# Altium project DM2080.PrjPcb (part 1 of 6)
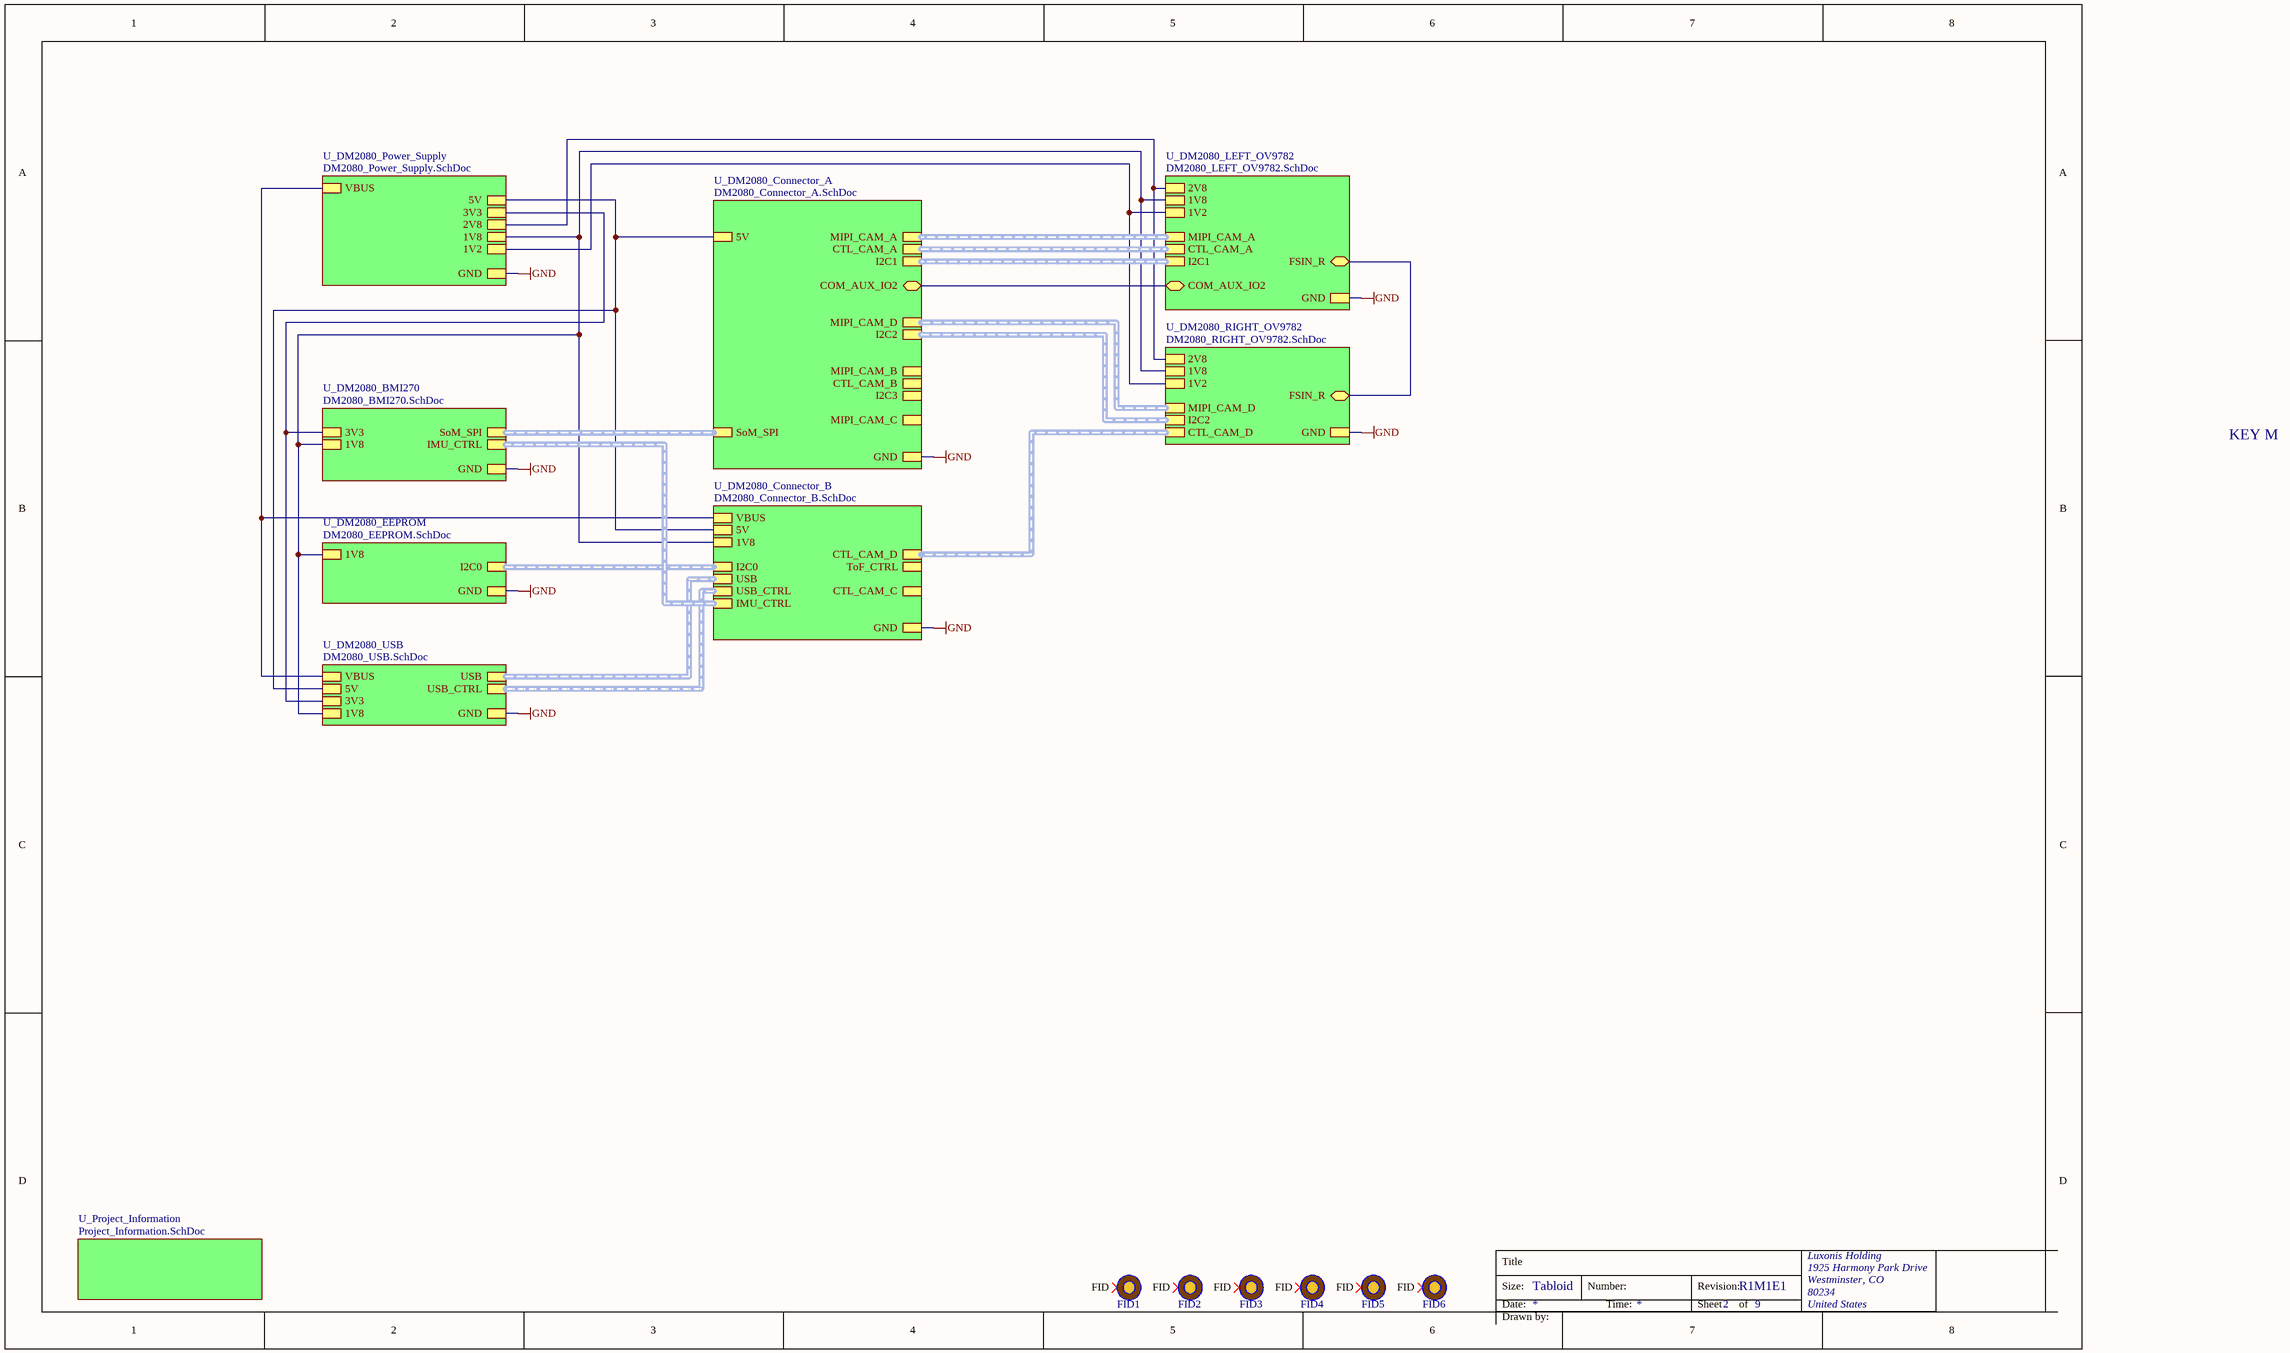
[diagram p0: TopLevel.SchDoc]
document_number: D0001093; drawn_by: David Malovrh; project_title: DM2080; revision: R1M1E1; variant: =Variant
10 sheets, 159 parts. Net scope: strictly hierarchical (ports join the sheet entries above them; power ports are local).
Board file: DM2080.PcbDoc
Sheets:
  TopLevel.SchDoc
    U_DM2080_BMI270 = DM2080_BMI270.SchDoc
    U_DM2080_Connector_A = DM2080_Connector_A.SchDoc
    U_DM2080_Connector_B = DM2080_Connector_B.SchDoc
    U_DM2080_LEFT_OV9782 = DM2080_LEFT_OV9782.SchDoc
    U_DM2080_Power_Supply = DM2080_Power_Supply.SchDoc
    U_DM2080_RIGHT_OV9782 = DM2080_RIGHT_OV9782.SchDoc
    U_DM2080_USB = DM2080_USB.SchDoc
    U_Project_Information = Project_Information.SchDoc
    U_DM2080_EEPROM = DM2080_EEPROM.SchDoc

## Sheet TopLevel.SchDoc: =project_title
size Tabloid; PageSetup: Record=PageOptions|CenterHorizontal=True|CenterVertical=True|PrintScale=0.73|XCorrection=1.00|YCorrection=1.00|PrintKind=0|BorderSize=5000000|LeftOffset=0|BottomOffset=0|Orientation=2|PaperLength=1000|PaperWidth=1000|Scale=100|PaperSource=7|PrintQuality=-4|MediaType=1|DitherType=10|PaperKind=A4|PrintScaleMode=1; CompanyName: Luxonis Holding; DrawnBy: David Malovrh; Organization: Luxonis Holding; Address1: 1925 Harmony Park Drive; Address2: Westminster, CO; Address3: 80234; Address4: United States; DocumentNumber: D0001093; Revision: R1M1E1; SheetNumber: 2; SheetTotal: 9

### Parts
FID1  FIDUCIAL_ROUND_1MM  [FIDUCIAL_ROUND_1MM]  (value not drawn)  (no BOM)
FID2  FIDUCIAL_ROUND_1MM  [FIDUCIAL_ROUND_1MM]  (value not drawn)  (no BOM)
FID3  FIDUCIAL_ROUND_1MM  [FIDUCIAL_ROUND_1MM]  (value not drawn)  (no BOM)
FID4  FIDUCIAL_ROUND_1MM  [FIDUCIAL_ROUND_1MM]  (value not drawn)  (no BOM)
FID5  FIDUCIAL_ROUND_1MM  [FIDUCIAL_ROUND_1MM]  (value not drawn)  (no BOM)
FID6  FIDUCIAL_ROUND_1MM  [FIDUCIAL_ROUND_1MM]  (value not drawn)  (no BOM)

### Sub-sheets
U_DM2080_BMI270 = DM2080_BMI270.SchDoc: GND, 3V3, 1V8, SoM_SPI (harness MX_SPI0), IMU_CTRL (harness IMU_CTRL)
U_DM2080_Connector_A = DM2080_Connector_A.SchDoc: MIPI_CAM_B (harness MIPI_CAM_B), I2C1 (harness I2C1), CTL_CAM_B (harness CTL_CAM_B), I2C2 (harness I2C2), MIPI_CAM_A (harness MIPI_CAM_A), CTL_CAM_A (harness CTL_CAM_A), MIPI_CAM_D (harness MIPI_CAM_D), COM_AUX_IO2 (bidir), I2C3 (harness I2C3), SoM_SPI (harness SoM_SPI), GND, MIPI_CAM_C (harness MIPI_CAM_C), 5V
U_DM2080_Connector_B = DM2080_Connector_B.SchDoc: 5V, GND, USB (harness USB_KB), 1V8, I2C0 (harness I2C0), IMU_CTRL (harness IMU_CTRL), ToF_CTRL (harness ToF_CTRL), USB_CTRL (harness USB_CTRL), CTL_CAM_D (harness CTL_CAM_D), VBUS, CTL_CAM_C (harness CTL_CAM_C)
U_DM2080_EEPROM = DM2080_EEPROM.SchDoc: 1V8, GND, I2C0 (harness I2C0)
U_DM2080_LEFT_OV9782 = DM2080_LEFT_OV9782.SchDoc: 1V2, 2V8, GND, 1V8, MIPI_CAM_A (harness MIPI_CAM_A), I2C1 (harness I2C1), CTL_CAM_A (harness CTL_CAM_A), COM_AUX_IO2 (bidir), FSIN_R (bidir)
U_DM2080_Power_Supply = DM2080_Power_Supply.SchDoc: 1V2, 2V8, GND, 3V3, 5V, VBUS, 1V8
U_DM2080_RIGHT_OV9782 = DM2080_RIGHT_OV9782.SchDoc: 1V2, 2V8, GND, 1V8, MIPI_CAM_D (harness MIPI_CAM_D), I2C2 (harness I2C2), CTL_CAM_D (harness CTL_CAM_A), FSIN_R (bidir)
U_DM2080_USB = DM2080_USB.SchDoc: USB (harness USB), VBUS, GND, 3V3, 5V, USB_CTRL (harness USB_CTRL), 1V8
U_Project_Information = Project_Information.SchDoc: no entries

### Nets
1V2: sheet U_DM2080_LEFT_OV9782/1V2, sheet U_DM2080_Power_Supply/1V2, sheet U_DM2080_RIGHT_OV9782/1V2
1V8: sheet U_DM2080_BMI270/1V8, sheet U_DM2080_Connector_B/1V8, sheet U_DM2080_LEFT_OV9782/1V8, sheet U_DM2080_Power_Supply/1V8, sheet U_DM2080_RIGHT_OV9782/1V8, sheet U_DM2080_USB/1V8, sheet U_DM2080_EEPROM/1V8
2V8: sheet U_DM2080_LEFT_OV9782/2V8, sheet U_DM2080_Power_Supply/2V8, sheet U_DM2080_RIGHT_OV9782/2V8
3V3: sheet U_DM2080_BMI270/3V3, sheet U_DM2080_Power_Supply/3V3, sheet U_DM2080_USB/3V3
5V: sheet U_DM2080_Connector_A/5V, sheet U_DM2080_Connector_B/5V, sheet U_DM2080_Power_Supply/5V, sheet U_DM2080_USB/5V
GND: sheet U_DM2080_BMI270/GND, sheet U_DM2080_Connector_A/GND, sheet U_DM2080_Connector_B/GND, sheet U_DM2080_LEFT_OV9782/GND, sheet U_DM2080_Power_Supply/GND, sheet U_DM2080_RIGHT_OV9782/GND, sheet U_DM2080_USB/GND, sheet U_DM2080_EEPROM/GND
VBUS: sheet U_DM2080_Connector_B/VBUS, sheet U_DM2080_Power_Supply/VBUS, sheet U_DM2080_USB/VBUS
COM_AUX_IO2: sheet U_DM2080_Connector_A/COM_AUX_IO2, sheet U_DM2080_LEFT_OV9782/COM_AUX_IO2
FSIN_R: sheet U_DM2080_LEFT_OV9782/FSIN_R, sheet U_DM2080_RIGHT_OV9782/FSIN_R

Not connected (* = marked no-connect by the designer): FID1 FID*; FID2 FID*; FID3 FID*; FID4 FID*; FID5 FID*; FID6 FID*

### Buses and harness runs
harness sheet U_DM2080_BMI270/IMU_CTRL = sheet U_DM2080_Connector_B/IMU_CTRL
harness sheet U_DM2080_BMI270/SoM_SPI = sheet U_DM2080_Connector_A/SoM_SPI
harness sheet U_DM2080_Connector_A/CTL_CAM_A = sheet U_DM2080_LEFT_OV9782/CTL_CAM_A
harness sheet U_DM2080_Connector_A/I2C1 = sheet U_DM2080_LEFT_OV9782/I2C1
harness sheet U_DM2080_Connector_A/I2C2 = sheet U_DM2080_RIGHT_OV9782/I2C2
harness sheet U_DM2080_Connector_A/MIPI_CAM_A = sheet U_DM2080_LEFT_OV9782/MIPI_CAM_A
harness sheet U_DM2080_Connector_A/MIPI_CAM_D = sheet U_DM2080_RIGHT_OV9782/MIPI_CAM_D
harness sheet U_DM2080_Connector_B/CTL_CAM_D = sheet U_DM2080_RIGHT_OV9782/CTL_CAM_D
harness sheet U_DM2080_Connector_B/I2C0 = sheet U_DM2080_EEPROM/I2C0
harness sheet U_DM2080_Connector_B/USB = sheet U_DM2080_USB/USB
harness sheet U_DM2080_Connector_B/USB_CTRL = sheet U_DM2080_USB/USB_CTRL

### Notes on the sheet
- KEY M
- Title
- Size:
- Date:
- Tabloid
- Number:
- Time:
- Revision:
- Sheet
- of
- Drawn by:

### Library data of the parts
FID1-FID6 = FIDUCIAL: Fiducial with various available footprints

## Sheet DM2080_BMI270.SchDoc: =project_title
size Tabloid; CompanyName: Luxonis Holding; DrawnBy: David Malovrh; Organization: Luxonis Holding; Address1: 1925 Harmony Park Drive; Address2: Westminster, CO; Address3: 80234; Address4: United States; DocumentNumber: D0001093; SheetNumber: 9; SheetTotal: 9
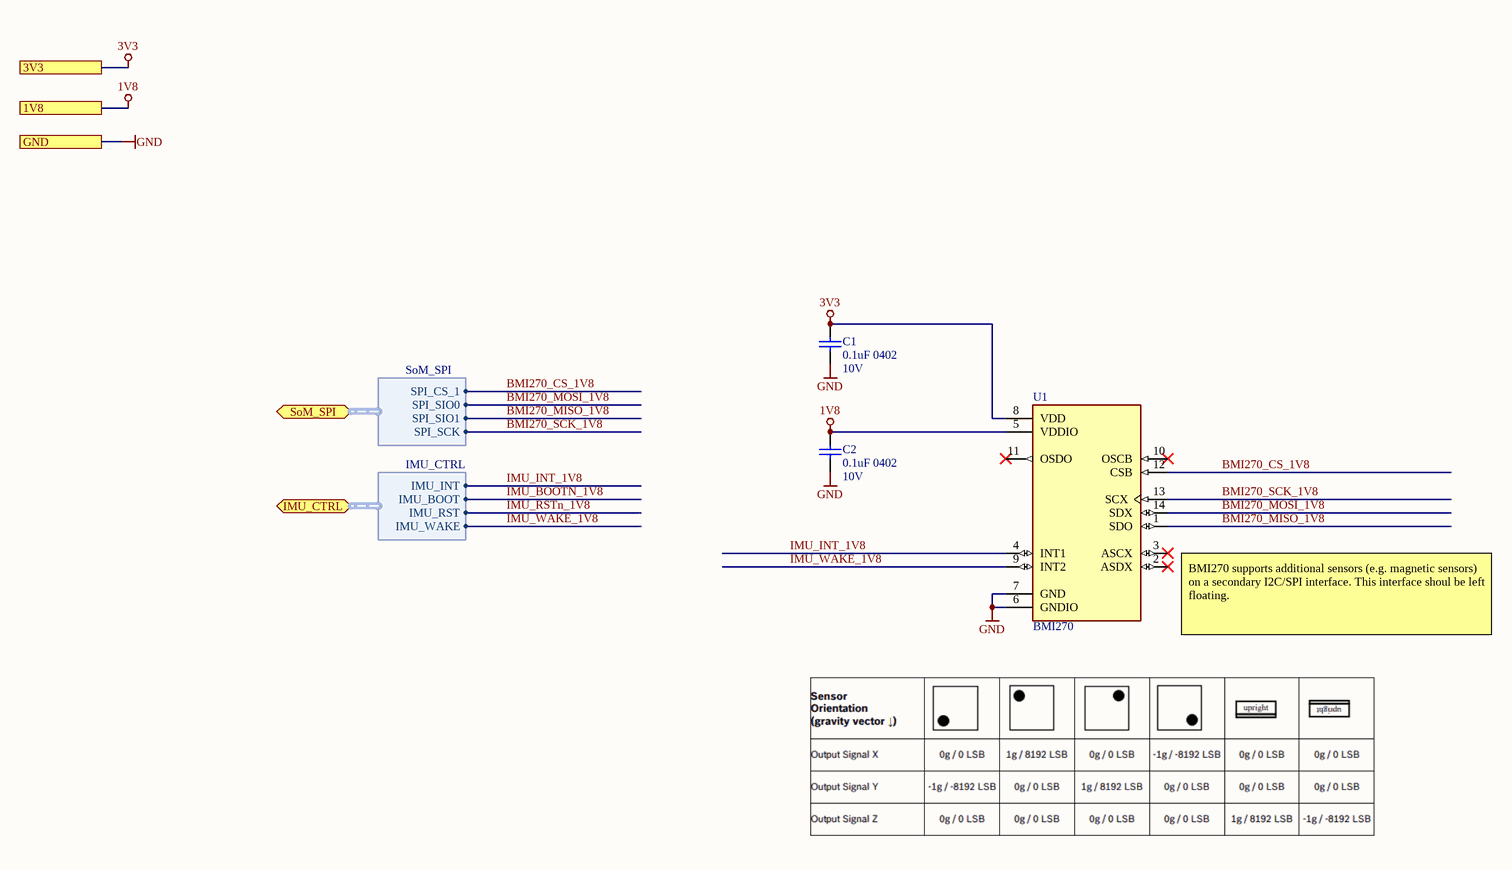
[diagram p1: DM2080_BMI270.SchDoc]

### Parts
C1  0.1uF 0402  Voltage Rating: 10V  [CAPC0402(1005)70_L]
C2  0.1uF 0402  Voltage Rating: 10V  [CAPC0402(1005)70_L]
U1  BMI270  [XDCR_BMI270]

### Ports
1V8, 3V3, GND, IMU_CTRL (bidir, harness IMU_CTRL), SoM_SPI (bidir, harness SoM_SPI)

### Harnesses
SoM_SPI: SPI_SIO0, SPI_SIO1, SPI_CS_1, SPI_SCK
IMU_CTRL: IMU_BOOT, IMU_RST, IMU_INT, IMU_WAKE

### Nets
1V8: C2.2 U1.5(VDDIO) ; port 1V8
3V3: C1.2 U1.8(VDD) ; port 3V3
GND: C1.1 C2.1 U1.6(GNDIO) U1.7(GND) ; port GND
BMI270_CS_1V8: U1.12(CSB) ; port SoM_SPI.SPI_CS_1
BMI270_MISO_1V8: U1.1(SDO) ; port SoM_SPI.SPI_SIO1
BMI270_MOSI_1V8: U1.14(SDX) ; port SoM_SPI.SPI_SIO0
BMI270_SCK_1V8: U1.13(SCX) ; port SoM_SPI.SPI_SCK
IMU_INT_1V8: U1.4(INT1) ; port IMU_CTRL.IMU_INT
IMU_WAKE_1V8: U1.9(INT2) ; port IMU_CTRL.IMU_WAKE

Not connected (* = marked no-connect by the designer): U1 2(ASDX)* 3(ASCX)* 10(OSCB)* 11(OSDO)*

### Notes on the sheet
- (near U1) BMI270 supports additional sensors (e.g. magnetic sensors) on a secondary I2C/SPI interface. This interface shoul be left floating.
- Title
- Size:
- Date:
- Tabloid
- Number:
- Time:
- Revision:
- Sheet
- of
- Drawn by:

### Library data of the parts
C1 C2 = GRM155R71A104JA01D: CAP CER 0.1UF 10V X7R 0402 5%; Manufacturer 1: Murata; Capacitance: 100nF; Supplier 1: Digi-Key; Manufacturer Part Number 1: GRM155R71A104JA01D; Stock 1: 1346709; Pricing 1: 1=0.10000, 10=0.02500, 100=0.01130, 500=0.00806, 1000=0.00633, 2500=0.00575, 5000=0.00529 (USD); RoHS: Yes; Mount: Surface Mount; Case/Package: 0402; Case Code (Imperial): 0402; Case Code (Metric): 1005; Min Operating Temperature: -55°C; Max Operating Temperature: 125°C; Tolerance: 5%; Packaging: Tape and Reel; Voltage Rating (DC): 10V; Dielectric: X7R; Package Quantity: 10000; Termination: SMD/SMT; Length: 1mm; Height: 0.5mm; Width: 0.02inch; Thickness: 0.022inch; Depth: 0.5mm; Radiation Hardening: No; Lead Free: Lead Free; ComponentLink1URL: https://datasheet.ciiva.com/5411/product-5411135.pdf?src-supplier=Mouser; ComponentLink1Description: https://datasheet.ciiva.com/5411/product-5411135.pdf?src-supplier=Mouser; ComponentLink2URL: https://datasheet.ciiva.com/11618/c02e-11618821.pdf?src-supplier=Avnet; ComponentLink2Description: https://datasheet.ciiva.com/11618/c02e-11618821.pdf?src-supplier=Avnet; Supplier Part Number 1: 490-10777-1-ND
U1 = BMI270: Accelerometer, Gyroscope, 6 Axis Sensor IÂ²C, SPI Output; Manufacturer 1: Bosch Sensortec; Price: None; SnapEDA_Link: https://www.snapeda.com/parts/BMI270/Bosch%20Sensortec/view-part/3595167/?ref=snap; Manufacturer Part Number 1: BMI270; Availability: Unavailable; Value: *; Package: LGA-14 Bosch Sensortec

## Sheet DM2080_Connector_A.SchDoc: =project_title
size Tabloid; CompanyName: Luxonis Holding; DrawnBy: David Malovrh; Organization: Luxonis Holding; Address1: 1925 Harmony Park Drive; Address2: Westminster, CO; Address3: 80234; Address4: United States; DocumentNumber: D0001093; Revision: R1M1E1; SheetNumber: 3; SheetTotal: 12
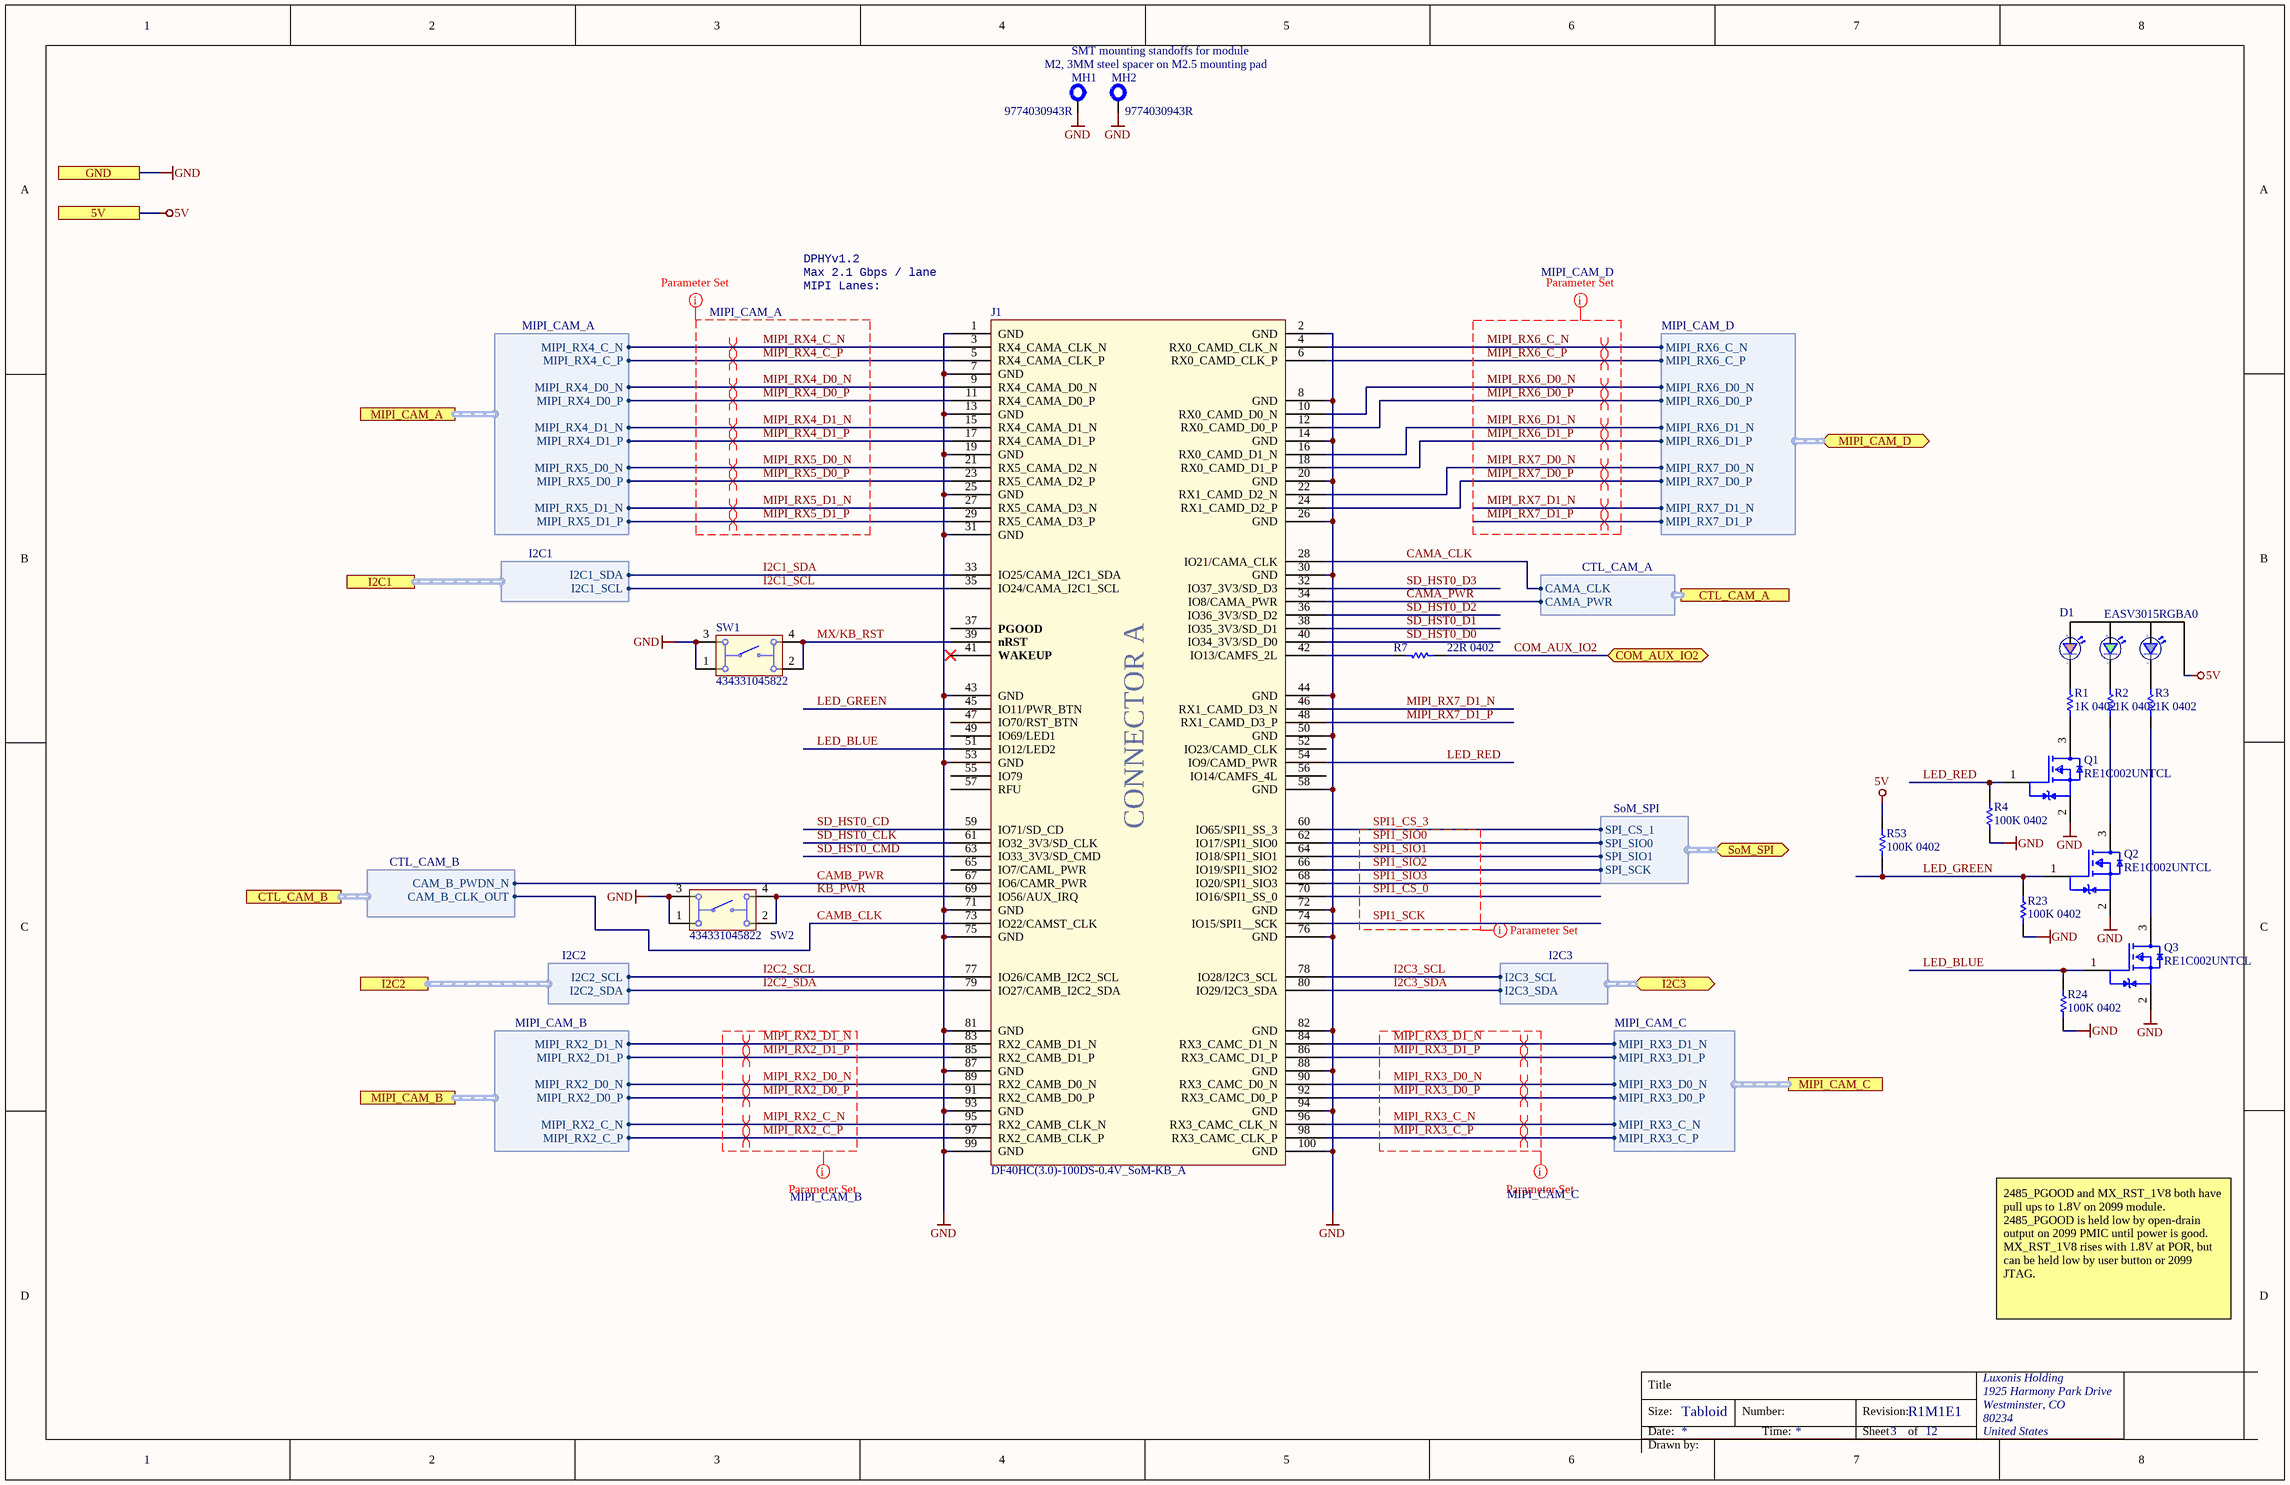
[diagram p2: DM2080_Connector_A.SchDoc]

### Parts
D1  EASV3015RGBA0  [EASV3015RGBA0]
J1  DF40HC(3.0)-100DS-0.4V_SoM-KB_A  [CON_A_SoM-Pro-KB_DF40HC-3.0-100DS-0.4V_minpad]
MH1  9774030943R  [9774030943R]
MH2  9774030943R  [9774030943R]
Q1  RE1C002UNTCL  [RE1C002UNTCL]
Q2  RE1C002UNTCL  [RE1C002UNTCL]
Q3  RE1C002UNTCL  [RE1C002UNTCL]
R1  1K 0402  [RESC0402(1005)_L]
R2  1K 0402  [RESC0402(1005)_L]
R3  1K 0402  [RESC0402(1005)_L]
R4  100K 0402  [RESC0402(1005)_L]
R7  22R 0402  [RESC0402(1005)_L]
R23  100K 0402  [RESC0402(1005)_L]
R24  100K 0402  [RESC0402(1005)_L]
R53  100K 0402  [RESC0402(1005)_L]
SW1  434331045822  [434331045822]
SW2  434331045822  [434331045822]

### Ports
5V, COM_AUX_IO2 (bidir), CTL_CAM_A (harness CTL_CAM_A), CTL_CAM_B (harness CTL_CAM_B), GND, I2C1 (harness I2C1), I2C2 (harness I2C2), I2C3 (bidir, harness I2C3), MIPI_CAM_A (harness MIPI_CAM_A), MIPI_CAM_B (harness MIPI_CAM_B), MIPI_CAM_C (harness MIPI_CAM_C), MIPI_CAM_D (bidir, harness MIPI_CAM_D), SoM_SPI (bidir, harness SoM_SPI)

### Harnesses
MIPI_CAM_B: MIPI_RX2_C_P, MIPI_RX2_C_N, MIPI_RX2_D0_P, MIPI_RX2_D0_N, MIPI_RX2_D1_P, MIPI_RX2_D1_N
MIPI_CAM_C: MIPI_RX3_C_P, MIPI_RX3_C_N, MIPI_RX3_D0_P, MIPI_RX3_D0_N, MIPI_RX3_D1_P, MIPI_RX3_D1_N
I2C1: I2C1_SDA, I2C1_SCL
CTL_CAM_B: CAM_B_CLK_OUT, CAM_B_PWDN_N
I2C2: I2C2_SDA, I2C2_SCL
MIPI_CAM_A: MIPI_RX4_C_P, MIPI_RX4_C_N, MIPI_RX4_D0_P, MIPI_RX4_D0_N, MIPI_RX4_D1_P, MIPI_RX4_D1_N, MIPI_RX5_D0_P, MIPI_RX5_D0_N, MIPI_RX5_D1_P, MIPI_RX5_D1_N
MIPI_CAM_D: MIPI_RX6_C_N, MIPI_RX6_C_P, MIPI_RX6_D0_N, MIPI_RX6_D0_P, MIPI_RX6_D1_N, MIPI_RX6_D1_P, MIPI_RX7_D0_N, MIPI_RX7_D0_P, MIPI_RX7_D1_N, MIPI_RX7_D1_P
I2C3: I2C3_SCL, I2C3_SDA
SoM_SPI: SPI_SIO0, SPI_SIO1, SPI_CS_1, SPI_SCK
CTL_CAM_A: CAMA_PWR, CAMA_CLK

### Nets
5V: D1.1(A) R53.1 ; port 5V
GND: J1.1(GND) J1.2(GND) J1.7(GND) J1.8(GND) J1.13(GND) J1.14(GND) J1.19(GND) J1.20(GND) J1.25(GND) J1.26(GND) J1.30(GND) J1.31(GND) J1.43(GND) J1.44(GND) J1.50(GND) J1.53(GND) J1.58(GND) J1.71(GND) J1.72(GND) J1.75(GND) J1.76(GND) J1.81(GND) J1.82(GND) J1.87(GND) J1.88(GND) J1.93(GND) J1.94(GND) J1.99(GND) J1.100(GND) MH1.1 MH2.1 Q1.2(Source) Q2.2(Source) Q3.2(Source) R4.2 R23.2 R24.2 SW1.1 SW1.3 SW2.1 SW2.3 ; port GND
CAMA_CLK: J1.28(IO21/CAMA_CLK) ; port CTL_CAM_A.CAMA_CLK
CAMA_PWR: J1.34(IO8/CAMA_PWR) ; port CTL_CAM_A.CAMA_PWR
CAMB_CLK: J1.73(IO22/CAMST_CLK) ; port CTL_CAM_B.CAM_B_CLK_OUT
CAMB_PWR: J1.67(IO6/CAMR_PWR) ; port CTL_CAM_B.CAM_B_PWDN_N
COM_AUX_IO2: R7.1 ; port COM_AUX_IO2
I2C1_SCL: J1.35(IO24/CAMA_I2C1_SCL) ; port I2C1.I2C1_SCL
I2C1_SDA: J1.33(IO25/CAMA_I2C1_SDA) ; port I2C1.I2C1_SDA
I2C2_SCL: J1.77(IO26/CAMB_I2C2_SCL) ; port I2C2.I2C2_SCL
I2C2_SDA: J1.79(IO27/CAMB_I2C2_SDA) ; port I2C2.I2C2_SDA
I2C3_SCL: J1.78(IO28/I2C3_SCL) ; port I2C3.I2C3_SCL
I2C3_SDA: J1.80(IO29/I2C3_SDA) ; port I2C3.I2C3_SDA
KB_PWR: J1.69(IO56/AUX_IRQ) SW2.2 SW2.4
LED_BLUE: J1.51(IO12/LED2) Q3.1(Gate) R24.1
LED_GREEN: J1.45(IO11/PWR_BTN) Q2.1(Gate) R23.1 R53.2
LED_RED: J1.54(IO9/CAMD_PWR) Q1.1(Gate) R4.1
MIPI_RX2_C_N: J1.95(RX2_CAMB_CLK_N) ; port MIPI_CAM_B.MIPI_RX2_C_N
MIPI_RX2_C_P: J1.97(RX2_CAMB_CLK_P) ; port MIPI_CAM_B.MIPI_RX2_C_P
MIPI_RX2_D0_N: J1.89(RX2_CAMB_D0_N) ; port MIPI_CAM_B.MIPI_RX2_D0_N
MIPI_RX2_D0_P: J1.91(RX2_CAMB_D0_P) ; port MIPI_CAM_B.MIPI_RX2_D0_P
MIPI_RX2_D1_N: J1.83(RX2_CAMB_D1_N) ; port MIPI_CAM_B.MIPI_RX2_D1_N
MIPI_RX2_D1_P: J1.85(RX2_CAMB_D1_P) ; port MIPI_CAM_B.MIPI_RX2_D1_P
MIPI_RX3_C_N: J1.96(RX3_CAMC_CLK_N) ; port MIPI_CAM_C.MIPI_RX3_C_N
MIPI_RX3_C_P: J1.98(RX3_CAMC_CLK_P) ; port MIPI_CAM_C.MIPI_RX3_C_P
MIPI_RX3_D0_N: J1.90(RX3_CAMC_D0_N) ; port MIPI_CAM_C.MIPI_RX3_D0_N
MIPI_RX3_D0_P: J1.92(RX3_CAMC_D0_P) ; port MIPI_CAM_C.MIPI_RX3_D0_P
MIPI_RX3_D1_N: J1.84(RX3_CAMC_D1_N) ; port MIPI_CAM_C.MIPI_RX3_D1_N
MIPI_RX3_D1_P: J1.86(RX3_CAMC_D1_P) ; port MIPI_CAM_C.MIPI_RX3_D1_P
MIPI_RX4_C_N: J1.3(RX4_CAMA_CLK_N) ; port MIPI_CAM_A.MIPI_RX4_C_N
MIPI_RX4_C_P: J1.5(RX4_CAMA_CLK_P) ; port MIPI_CAM_A.MIPI_RX4_C_P
MIPI_RX4_D0_N: J1.9(RX4_CAMA_D0_N) ; port MIPI_CAM_A.MIPI_RX4_D0_N
MIPI_RX4_D0_P: J1.11(RX4_CAMA_D0_P) ; port MIPI_CAM_A.MIPI_RX4_D0_P
MIPI_RX4_D1_N: J1.15(RX4_CAMA_D1_N) ; port MIPI_CAM_A.MIPI_RX4_D1_N
MIPI_RX4_D1_P: J1.17(RX4_CAMA_D1_P) ; port MIPI_CAM_A.MIPI_RX4_D1_P
MIPI_RX5_D0_N: J1.21(RX5_CAMA_D2_N) ; port MIPI_CAM_A.MIPI_RX5_D0_N
MIPI_RX5_D0_P: J1.23(RX5_CAMA_D2_P) ; port MIPI_CAM_A.MIPI_RX5_D0_P
MIPI_RX5_D1_N: J1.27(RX5_CAMA_D3_N) ; port MIPI_CAM_A.MIPI_RX5_D1_N
MIPI_RX5_D1_P: J1.29(RX5_CAMA_D3_P) ; port MIPI_CAM_A.MIPI_RX5_D1_P
MIPI_RX6_C_N: J1.4(RX0_CAMD_CLK_N) ; port MIPI_CAM_D.MIPI_RX6_C_N
MIPI_RX6_C_P: J1.6(RX0_CAMD_CLK_P) ; port MIPI_CAM_D.MIPI_RX6_C_P
MIPI_RX6_D0_N: J1.10(RX0_CAMD_D0_N) ; port MIPI_CAM_D.MIPI_RX6_D0_N
MIPI_RX6_D0_P: J1.12(RX0_CAMD_D0_P) ; port MIPI_CAM_D.MIPI_RX6_D0_P
MIPI_RX6_D1_N: J1.16(RX0_CAMD_D1_N) ; port MIPI_CAM_D.MIPI_RX6_D1_N
MIPI_RX6_D1_P: J1.18(RX0_CAMD_D1_P) ; port MIPI_CAM_D.MIPI_RX6_D1_P
MIPI_RX7_D0_N: J1.22(RX1_CAMD_D2_N) ; port MIPI_CAM_D.MIPI_RX7_D0_N
MIPI_RX7_D0_P: J1.24(RX1_CAMD_D2_P) ; port MIPI_CAM_D.MIPI_RX7_D0_P
MIPI_RX7_D1_N: J1.46(RX1_CAMD_D3_N) ; port MIPI_CAM_D.MIPI_RX7_D1_N
MIPI_RX7_D1_P: J1.48(RX1_CAMD_D3_P) ; port MIPI_CAM_D.MIPI_RX7_D1_P
MX/KB_RST: J1.39(nRST) SW1.2 SW1.4
SD_HST0_CD: J1.59(IO71/SD_CD)
SD_HST0_CLK: J1.61(IO32_3V3/SD_CLK)
SD_HST0_CMD: J1.63(IO33_3V3/SD_CMD)
SD_HST0_D0: J1.40(IO34_3V3/SD_D0)
SD_HST0_D1: J1.38(IO35_3V3/SD_D1)
SD_HST0_D2: J1.36(IO36_3V3/SD_D2)
SD_HST0_D3: J1.32(IO37_3V3/SD_D3)
SPI1_CS_0: J1.70(IO16/SPI1_SS_0)
SPI1_CS_3: J1.60(IO65/SPI1_SS_3) ; port SoM_SPI.SPI_CS_1  [project net BMI270_CS_1V8]
SPI1_SCK: J1.74(IO15/SPI1__SCK)
SPI1_SIO0: J1.62(IO17/SPI1_SIO0) ; port SoM_SPI.SPI_SIO0  [project net BMI270_MOSI_1V8]
SPI1_SIO1: J1.64(IO18/SPI1_SIO1) ; port SoM_SPI.SPI_SIO1  [project net BMI270_MISO_1V8]
SPI1_SIO2: J1.66(IO19/SPI1_SIO2) ; port SoM_SPI.SPI_SCK  [project net BMI270_SCK_1V8]
SPI1_SIO3: J1.68(IO20/SPI1_SIO3)
NetD1_2: D1.2(C) R3.2
NetD1_3: D1.3(C) R2.2
NetD1_4: D1.4(C) R1.2
NetJ1_42: J1.42(IO13/CAMFS_2L) R7.2
NetQ1_3: Q1.3(Drain) R1.1
NetQ2_3: Q2.3(Drain) R2.1
NetQ3_3: Q3.3(Drain) R3.1

Not connected (* = marked no-connect by the designer): J1 37(PGOOD) 41(WAKEUP)* 47(IO70/RST_BTN) 49(IO69/LED1) 52(IO23/CAMD_CLK) 55(IO79) 56(IO14/CAMFS_4L) 57(RFU) 65(IO7/CAML_PWR)

### Layout directives
net class MIPI_CAM_B; rule Matched Net Lengths [Delay Tolerance = 1ps]: MIPI_RX2_C_N, MIPI_RX2_C_P, MIPI_RX2_D0_N, MIPI_RX2_D0_P, MIPI_RX2_D1_N, MIPI_RX2_D1_P
differential pair; differential pair class 100ohm: MIPI_RX2_C_N, MIPI_RX2_C_P, MIPI_RX2_D0_N, MIPI_RX2_D0_P, MIPI_RX2_D1_N, MIPI_RX2_D1_P, MIPI_RX3_C_N, MIPI_RX3_C_P, MIPI_RX3_D0_N, MIPI_RX3_D0_P, MIPI_RX3_D1_N, MIPI_RX3_D1_P, MIPI_RX4_C_N, MIPI_RX4_C_P, MIPI_RX4_D0_N, MIPI_RX4_D0_P, MIPI_RX4_D1_N, MIPI_RX4_D1_P, MIPI_RX5_D0_N, MIPI_RX5_D0_P, MIPI_RX5_D1_N, MIPI_RX5_D1_P, MIPI_RX6_C_N, MIPI_RX6_C_P, MIPI_RX6_D0_N, MIPI_RX6_D0_P, MIPI_RX6_D1_N, MIPI_RX6_D1_P, MIPI_RX7_D0_N, MIPI_RX7_D0_P, MIPI_RX7_D1_N, MIPI_RX7_D1_P
net class MIPI_CAM_C; rule Matched Net Lengths [Delay Tolerance = 1ps]: MIPI_RX3_C_N, MIPI_RX3_C_P, MIPI_RX3_D0_N, MIPI_RX3_D0_P, MIPI_RX3_D1_N, MIPI_RX3_D1_P
net class SPI0: SPI1_CS_0, SPI1_CS_3, SPI1_SCK, SPI1_SIO0, SPI1_SIO1, SPI1_SIO2, SPI1_SIO3
net class MIPI_CAM_A; rule Matched Net Lengths [Delay Tolerance = 1ps]; rule Matched Net Lengths [Delay Tolerance = 0,5ps]: MIPI_RX4_C_N, MIPI_RX4_C_P, MIPI_RX4_D0_N, MIPI_RX4_D0_P, MIPI_RX4_D1_N, MIPI_RX4_D1_P, MIPI_RX5_D0_N, MIPI_RX5_D0_P, MIPI_RX5_D1_N, MIPI_RX5_D1_P
net class MIPI_CAM_D; rule Matched Net Lengths [Delay Tolerance = 1ps]; rule Matched Net Lengths [Delay Tolerance = 0,5ps]: MIPI_RX6_C_N, MIPI_RX6_C_P, MIPI_RX6_D0_N, MIPI_RX6_D0_P, MIPI_RX6_D1_N, MIPI_RX6_D1_P, MIPI_RX7_D0_N, MIPI_RX7_D0_P, MIPI_RX7_D1_N, MIPI_RX7_D1_P

### Notes on the sheet
- M2, 3MM steel spacer on M2.5 mounting pad
- SMT mounting standoffs for module
- MIPI Lanes:
- Max 2.1 Gbps / lane
- DPHYv1.2
- 2485_PGOOD and MX_RST_1V8 both have pull ups to 1.8V on 2099 module. 2485_PGOOD is held low by open-drain output on 2099 PMIC until power is good. MX_RST_1V8 rises with 1.8V at POR, but can be held low by user button or 2099 JTAG.
- Title
- Size:
- Date:
- Tabloid
- Number:
- Time:
- Revision:
- Sheet
- of
- Drawn by:
- (in symbol CMP-038-000000-5) CONNECTOR A

### Library data of the parts
D1 = EASV3015RGBA0: LED Tri-Color Blue/Green/Red 468nm/518nm/632nm 4-Pin SMD; Manufacturer 1: Everlight; Color: Blue,Green,Red; Lens Color: Colorless; Lens Transparency: Clear; Luminous Intensity: 50mcd; Test Current: 20mA; Viewing Angle: 100°; Dominant Wavelength: 470nm; Forward Voltage: 3.3V; Supplier 1: Future Electronics; RoHS: Yes; Category: LEDs; Mount: Surface Mount; Case/Package: SMD/SMT; Packaging: Tape and Reel; Length: 3mm; Width: 1.5mm; Height: 1.1mm; Lead Free: Lead Free; RoHS Compliant: Yes; ComponentLink1URL: https://everlightamericas.com/index.php?controller=attachment&id_attachment=1129&src-supplier=Digi-Key; ComponentLink1Description: https://everlightamericas.com/index.php?controller=attachment&id_attachment=1129&src-supplier=Digi-Key; ComponentLink2URL: https://everlightamericas.com/index.php?controller=attachment&amp;id_attachment=3220&src-supplier=Digi-Key; ComponentLink2Description: https://everlightamericas.com/index.php?controller=attachment&amp;id_attachment=3220&src-supplier=Digi-Key; ComponentLink3URL: https://everlightamericas.com/index.php?controller=attachment&id_attachment=3220&src-supplier=Digi-Key; ComponentLink3Description: https://everlightamericas.com/index.php?controller=attachment&id_attachment=3220&src-supplier=Digi-Key; Manufacturer Part Number 1: EASV3015RGBA0; Supplier Part Number 1: 9074476; Stock 1: 6000; Pricing 1: 2000=0,11600, 6000=0,09680, 10000=0,09580, 20000=0,09450, 40000=0,09310 (USD)
J1 = CMP-038-000000-5: OAK-SoM-Pro-S3 base board conn. A; Manufacturer 1: Hirose; Manufacturer Part Number 1: DF40HC(3.0)-100DS-0.4V(58); Pitch: 0.016inch; Number of Positions: 100; Connector Type: Receptacle; System: Connector; ComponentLink2URL: https://datasheet.ciiva.com/18562/ed-df40-20140305-18562189.pdf?src-supplier=Digi-Key; ComponentLink3Description: https://datasheet.ciiva.com/13559/ed-df40-20140305-13559540.pdf?src-supplier=Mouser; Packaging: Tape and Reel; Design Item ID: DF40HC(3.0)-100DS-0.4V_SoM-KB_A; Pricing 2: 1=2.50000, 10=2.40000, 25=2.10000, 50=2.10000, 100=2.00000, 250=1.76000, 500=1.71000, 1000=1.45000, 2000=1.36000, 5000=1.31000, 10000=1.31000 (USD); Package Quantity: 1000; Stock 2: 2078; Contact Plating: Gold; ComponentLink4Description: https://datasheet.ciiva.com/18562/ed-df40-20140305-18562462.pdf?src-supplier=Digi-Key; ComponentLink2Description: https://datasheet.ciiva.com/18562/ed-df40-20140305-18562189.pdf?src-supplier=Digi-Key; ComponentLink3URL: https://datasheet.ciiva.com/13559/ed-df40-20140305-13559540.pdf?src-supplier=Mouser; Mount: Surface Mount; Lead Free: Lead Free; ComponentLink4URL: https://datasheet.ciiva.com/18562/ed-df40-20140305-18562462.pdf?src-supplier=Digi-Key; ComponentLink1Description: https://datasheet.ciiva.com/46636/ed-df40-20140305-46636517.pdf?src-supplier=Digi-Key; Source: OAK-SoM-Pro-KB.SchLib; RoHS: Yes; Pricing 1: 1=2.54000, 10=2.26000, 25=2.07000, 50=2.07000, 100=1.98000, 250=1.79000, 500=1.65000, 1000=1.41000, 3000=1.32000, 6000=1.23000, 10000=1.23000 (USD); Stock 1: 2172; Number of Rows: 2; ComponentLink1URL: https://datasheet.ciiva.com/46636/ed-df40-20140305-46636517.pdf?src-supplier=Digi-Key
MH1 MH2 = CMP-090-000000-1: Spacers/Standoffs; Manufacturer 1: Wurth Electronics; Pricing 1: 1=0,81000, 10=0,75600, 50=0,70200, 100=0,62100 (USD); ComponentLink3URL: http://www.farnell.com/datasheets/2305586.pdf?src-supplier=Element14; Stock 1: 354; Category: Spacers, Standoffs; Manufacturer Part Number 1: 9774030943R; ComponentLink2URL: http://www.farnell.com/datasheets/2305586.pdf?src-supplier=Newark; ComponentLink3Description: http://www.farnell.com/datasheets/2305586.pdf?src-supplier=Element14; ComponentLink1URL: https://katalog.we-online.de/em/datasheet/9774030943.pdf?src-supplier=Digi-Key; Design Item ID: 9774030943R; Source: DM2097_R1M1E1.SCHLIB; ComponentLink1Description: https://katalog.we-online.de/em/datasheet/9774030943.pdf?src-supplier=Digi-Key; ComponentLink2Description: http://www.farnell.com/datasheets/2305586.pdf?src-supplier=Newark; RoHS: Yes
Q1-Q3 = RE1C002UNTCL: MOSFET N-CH 20V 0.2A EMT3; Manufacturer 1: Rohm; Continuous Drain Current (ID): 200mA; Rds On Max: 1.2R; Input Capacitance: 25pF; Max Power Dissipation: 150mW; RoHS: Yes; Mount: Surface Mount; Case/Package: SOT-89; Packaging: Tape and Reel; Drain to Source Voltage (Vdss): 20V; Lead Free: Lead Free; ComponentLink1URL: http://www.mouser.com/ds/2/348/re1c002untcl-e-1018231.pdf?src-supplier=Mouser; ComponentLink1Description: http://www.mouser.com/ds/2/348/re1c002untcl-e-1018231.pdf?src-supplier=Mouser; ComponentLink2URL: http://rohmfs.rohm.com/en/techdata_basic/transistor/taping/EMT3_TL_taping.pdf?src-supplier=Digi-Key; ComponentLink2Description: http://rohmfs.rohm.com/en/techdata_basic/transistor/taping/EMT3_TL_taping.pdf?src-supplier=Digi-Key; ComponentLink3URL: http://rohmfs.rohm.com/en/products/databook/datasheet/discrete/transistor/mosfet/re1c002un.pdf?src-supplier=Avnet; ComponentLink3Description: http://rohmfs.rohm.com/en/products/databook/datasheet/discrete/transistor/mosfet/re1c002un.pdf?src-supplier=Avnet; ComponentLink4URL: https://www.rohm.com/datasheet/RE1C002UN/re1c002untcl-e?src-supplier=Digi-Key; ComponentLink4Description: https://www.rohm.com/datasheet/RE1C002UN/re1c002untcl-e?src-supplier=Digi-Key; ComponentLink5URL: http://www.farnell.com/datasheets/2704376.pdf?src-supplier=Newark; ComponentLink5Description: http://www.farnell.com/datasheets/2704376.pdf?src-supplier=Newark; ComponentLink6URL: http://www.farnell.com/datasheets/2704376.pdf?src-supplier=Farnell; ComponentLink6Description: http://www.farnell.com/datasheets/2704376.pdf?src-supplier=Farnell; ComponentLink7URL: http://www.farnell.com/datasheets/2704376.pdf?src-supplier=Element14; ComponentLink7Description: http://www.farnell.com/datasheets/2704376.pdf?src-supplier=Element14; Supplier 1: Digi-Key; Manufacturer Part Number 1: RE1C002UNTCL; Stock 1: 868886; Pricing 1: 1=0.20000, 10=0.18200, 100=0.09930, 500=0.06112, 1000=0.04167 (USD); Supplier Part Number 1: RE1C002UNTCLCT-ND
R1-R3 = RC0402FR-071KL: RES SMD 1K OHM 1% 1/16W 0402; Manufacturer 1: Yageo; Temperature Coefficient: 100ppm/°C; Power Rating: 62.5mW; Voltage Rating (DC): 50V; Resistance: 1kR; RoHS: Yes; Number of Pins: 2; Case Code (Imperial): 0402; Case Code (Metric): 1005; Min Operating Temperature: -55°C; Max Operating Temperature: 155°C; Packaging: Tape and Reel; Composition: Thick Film; Voltage Rating: 50V; Military Standard: Not; Termination: SMD/SMT; Length: 1mm; Height: 0.32mm; Width: 0.5mm; Depth: 0.5mm; Lead Free: Lead Free; REACH SVHC: Unknown; ComponentLink1URL: https://datasheet.ciiva.com/11819/0900766b80c66297-11819477.pdf?src-supplier=RSComponents; ComponentLink1Description: https://datasheet.ciiva.com/11819/0900766b80c66297-11819477.pdf?src-supplier=RSComponents; ComponentLink2URL: https://datasheet.ciiva.com/12666/pyu-rc0402-51-rohs-l-6-r-12666741.pdf?src-supplier=Mouser; ComponentLink2Description: https://datasheet.ciiva.com/12666/pyu-rc0402-51-rohs-l-6-r-12666741.pdf?src-supplier=Mouser; ComponentLink3URL: https://datasheet.ciiva.com/17063/pyu-rc0402-51-rohs-l-6-r-17063193.pdf?src-supplier=Future+Electronics; ComponentLink3Description: https://datasheet.ciiva.com/17063/pyu-rc0402-51-rohs-l-6-r-17063193.pdf?src-supplier=Future+Electronics; ComponentLink4URL: https://datasheet.ciiva.com/22747/1018594-22747513.pdf?src-supplier=Element14; ComponentLink4Description: https://datasheet.ciiva.com/22747/1018594-22747513.pdf?src-supplier=Element14; ComponentLink5URL: https://datasheet.ciiva.com/7849/1018594-7849869.pdf?src-supplier=Element14; ComponentLink5Description: https://datasheet.ciiva.com/7849/1018594-7849869.pdf?src-supplier=Element14; ComponentLink6URL: https://datasheet.ciiva.com/7983/1018594-7983502.pdf?src-supplier=Element14; ComponentLink6Description: https://datasheet.ciiva.com/7983/1018594-7983502.pdf?src-supplier=Element14; ComponentLink7URL: https://datasheet.ciiva.com/7849/1018594-7849871.pdf?src-supplier=Element14; ComponentLink7Description: https://datasheet.ciiva.com/7849/1018594-7849871.pdf?src-supplier=Element14; Supplier 1: Digi-Key; Manufacturer Part Number 1: RC0402FR-071KL; Stock 1: 60695854; Pricing 1: 1=0.10000, 10=0.01600, 100=0.00670, 1000=0.00301, 2500=0.00261, 5000=0.00215 (USD); Case/Package: 0402; Tolerance: 1%; Supplier Part Number 1: 311-1.00KLRCT-ND
R4 R23 R24 R53 = CMP-013-000035-2: RES SMD 100K OHM 1% 1/16W 0402; Manufacturer 1: Yageo; Manufacturer Part Number 1: RC0402FR-07100KL; Voltage Rating: 50V; Power Rating: 63mW; Resistance: 100kR; Length: 0.039inch; Height: 0.016inch; Tolerance: 1%; Case/Package: 0402; Design Item ID: RC0402FR-07100KL; Max Power Dissipation: 63mW; Case Code (Metric): 1005; Max Operating Temperature: 155°C; Min Operating Temperature: -55°C; Case Code (Imperial): 0402; Depth: 0.5mm
R7 = RC0402FR-0722RL: RES SMD 22 OHM 1% 1/16W 0402; Manufacturer 1: Yageo; Temperature Coefficient: 100ppm/°C; Power Rating: 63mW; Voltage Rating: 50V; Supplier 1: Digi-Key; Manufacturer Part Number 1: RC0402FR-0722RL; Stock 1: 23751364; Pricing 1: 10000=0.00163, 30000=0.00144, 50000=0.00132, 100000=0.00129 (USD); RoHS: Yes; Case/Package: 0402; Number of Pins: 2; Case Code (Metric): 1005; Case Code (Imperial): 0402; Min Operating Temperature: -55°C; Max Operating Temperature: 155°C; Tolerance: 1%; Resistance: 22R; Packaging: Tape and Reel; Composition: Thick Film; Voltage Rating (DC): 50V; Termination: SMD/SMT; Military Standard: Not; Length: 1mm; Height: 0.32mm; Width: 0.5mm; Depth: 0.5mm; REACH SVHC: Unknown; Lead Free: Lead Free; ComponentLink1URL: https://datasheet.ciiva.com/11819/0900766b80c66297-11819462.pdf?src-supplier=RSComponents; ComponentLink1Description: https://datasheet.ciiva.com/11819/0900766b80c66297-11819462.pdf?src-supplier=RSComponents; ComponentLink2URL: https://datasheet.ciiva.com/7849/1018594-7849911.pdf?src-supplier=Element14; ComponentLink2Description: https://datasheet.ciiva.com/7849/1018594-7849911.pdf?src-supplier=Element14; ComponentLink3URL: https://datasheet.ciiva.com/26829/getdatasheetpartid-554995-26829991.pdf?src-supplier=Verical; ComponentLink3Description: https://datasheet.ciiva.com/26829/getdatasheetpartid-554995-26829991.pdf?src-supplier=Verical; ComponentLink4URL: https://datasheet.ciiva.com/7849/1018594-7849912.pdf?src-supplier=Element14; ComponentLink4Description: https://datasheet.ciiva.com/7849/1018594-7849912.pdf?src-supplier=Element14; ComponentLink5URL: https://datasheet.ciiva.com/16930/pyu-rc0402-51-rohs-l-6-r-16930687.pdf?src-supplier=Future+Electronics; ComponentLink5Description: https://datasheet.ciiva.com/16930/pyu-rc0402-51-rohs-l-6-r-16930687.pdf?src-supplier=Future+Electronics; Supplier 2: Newark; Supplier 3: Mouser; Supplier Part Number 2: 26M6784; Supplier Part Number 3: 603-RC0402FR-0722RL; Supplier Part Number 1: 311-22.0LRTR-ND
SW1 SW2 = CMP-011-00016-3: Keypad Switch, 1 Switches, SPST, Momentary-tactile, 0.05A, 12VDC, 2.65N, Solder Terminal, Surface Mount-right Angle; Manufacturer 1: Wurth Electronics; Voltage Rating: 12V; Max Current Rating: 50mA; Throw Configuration: SPST-NO; Supplier Part Number 1: 732-7055-2-ND; Manufacturer part number 1: 434331045822; Pins: 4; Supplier 1: Digi-Key; Current Rating: 50mA; Mounting Technology: SMD; Case/Package: 434331045822

## Sheet DM2080_Connector_B.SchDoc: =project_title
size Tabloid; CompanyName: Luxonis Holding; DrawnBy: David Malovrh; Organization: Luxonis Holding; Address1: 1925 Harmony Park Drive; Address2: Westminster, CO; Address3: 80234; Address4: United States; DocumentNumber: D0001093; Revision: R1M1E1; SheetNumber: 3; SheetTotal: 12
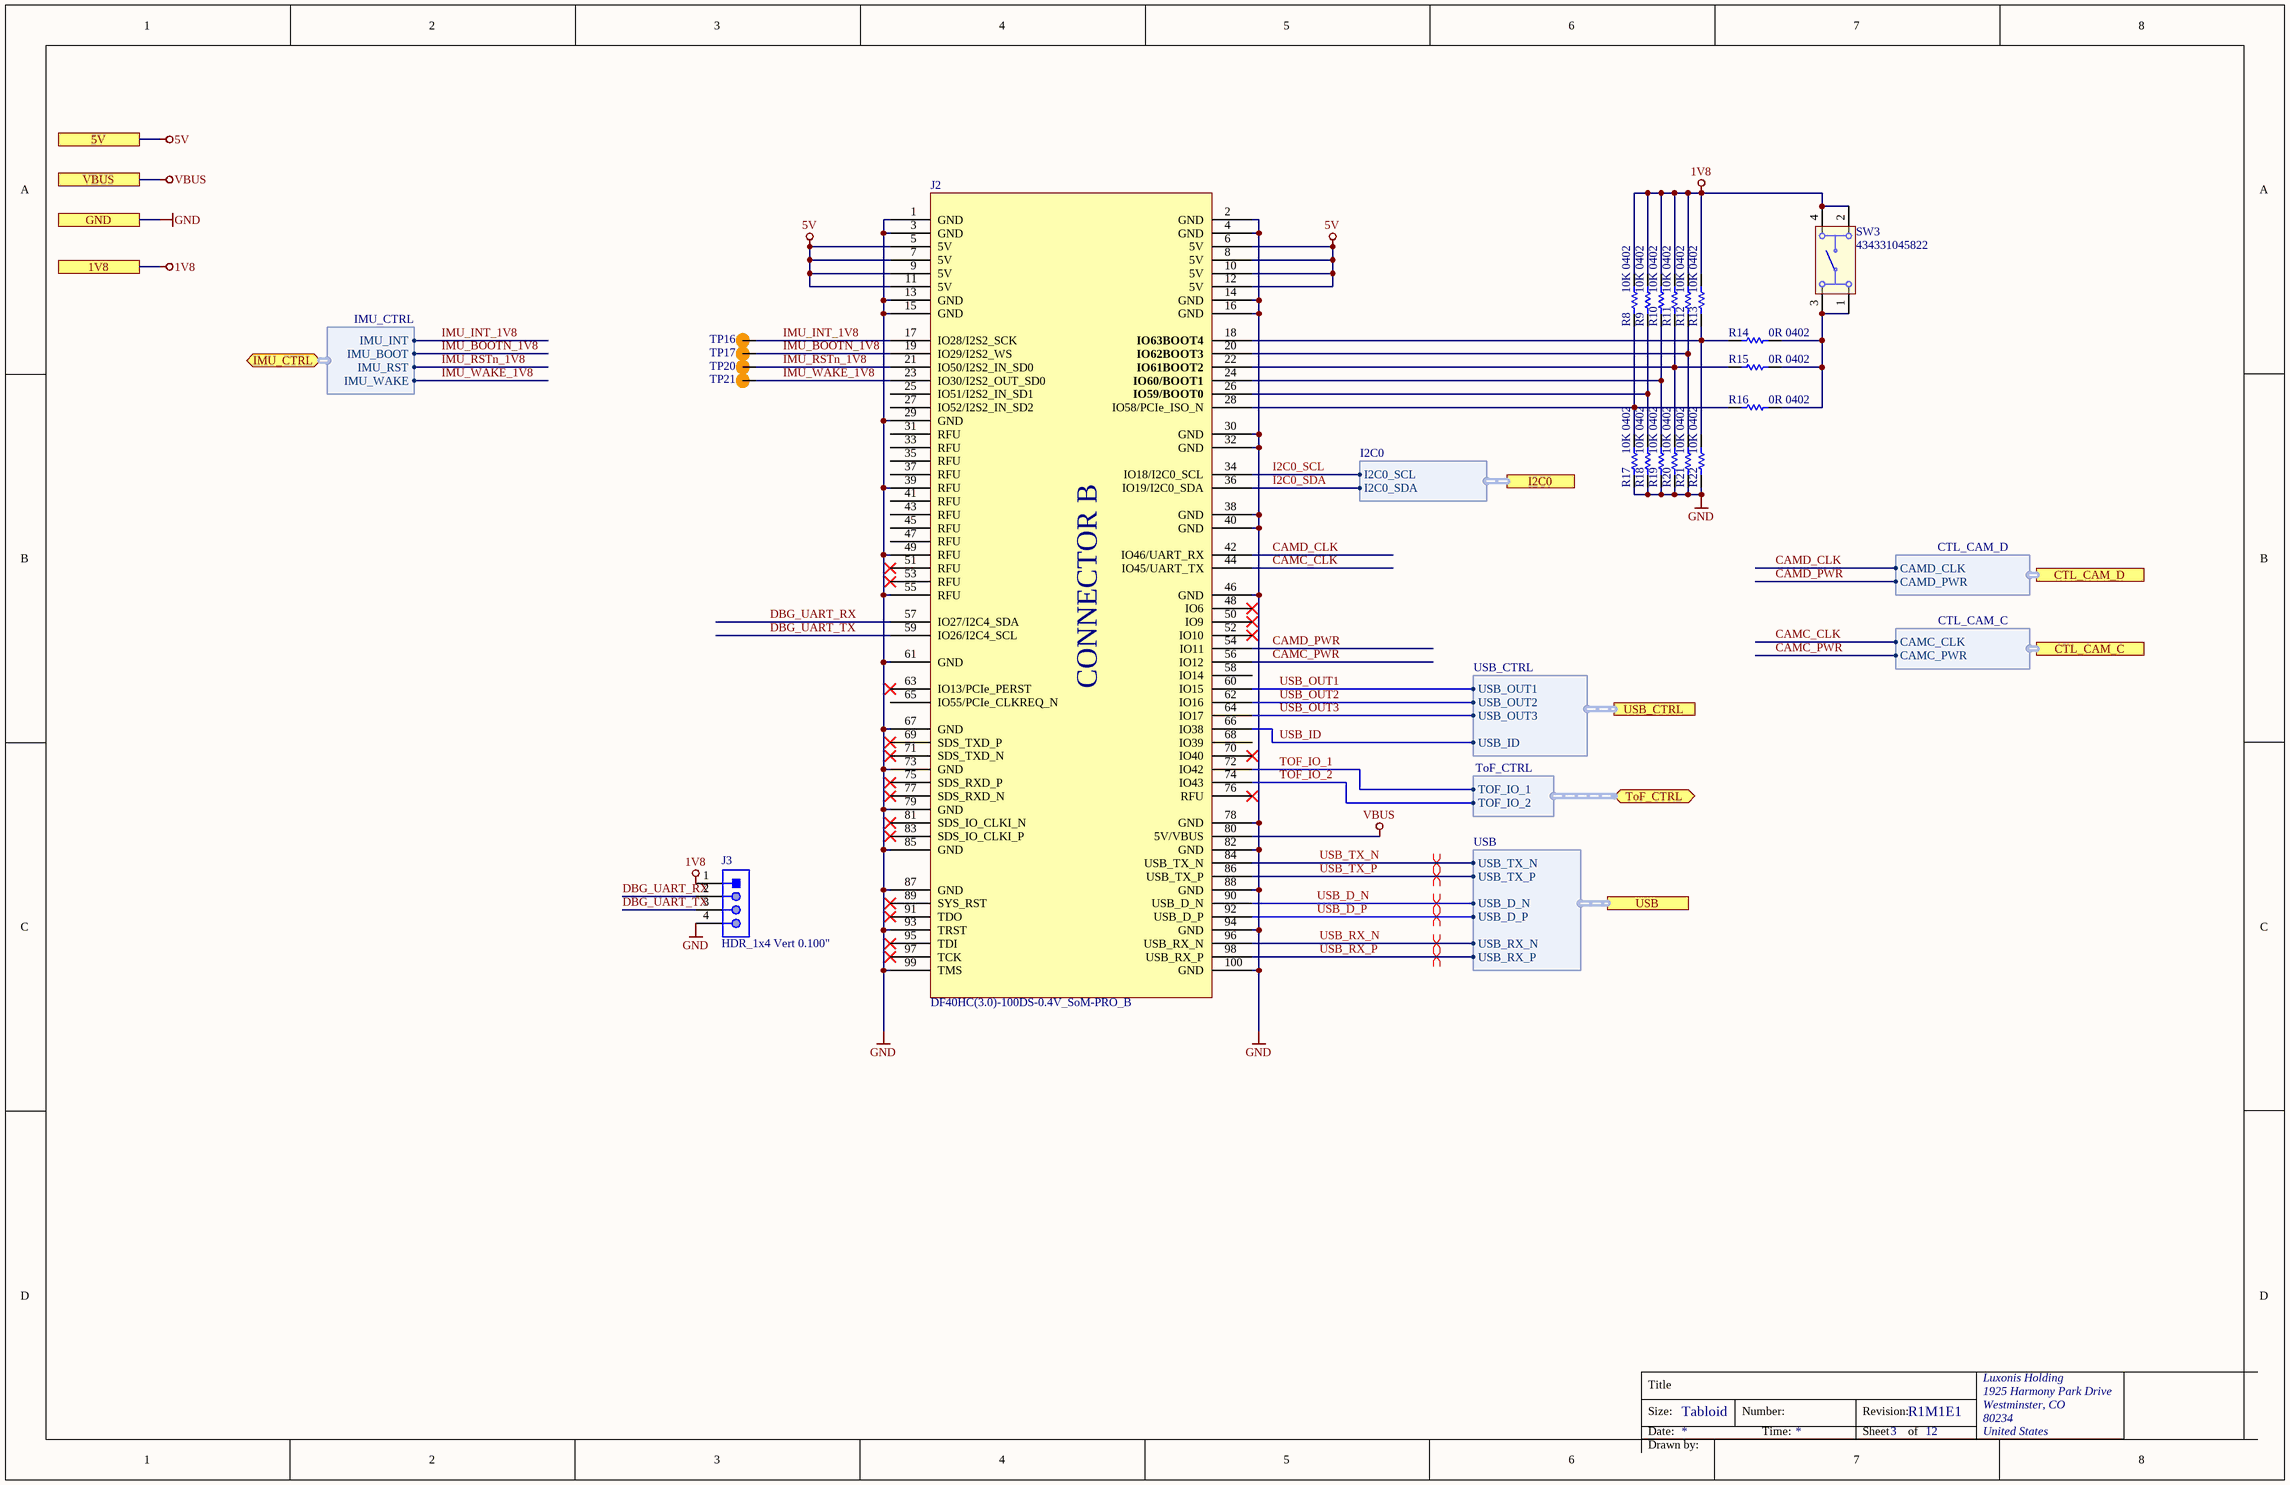
[diagram p3: DM2080_Connector_B.SchDoc]

### Parts
J2  DF40HC(3.0)-100DS-0.4V_SoM-PRO_B  [CON_B_BW2099_SoM_DF40HC-3.0-100DS-0.4V_minpad]
J3  HDR_1x4 Vert 0.100"  [61300411121]
R8  10K 0402  [RESC0402(1005)_L]
R9  10K 0402  [RESC0402(1005)_L]
R10  10K 0402  [RESC0402(1005)_L]
R11  10K 0402  [RESC0402(1005)_L]
R12  10K 0402  [RESC0402(1005)_L]
R13  10K 0402  [RESC0402(1005)_L]
R14  0R 0402  [RESC0402(1005)_L]
R15  0R 0402  [RESC0402(1005)_L]
R16  0R 0402  [RESC0402(1005)_L]
R17  10K 0402  [RESC0402(1005)_L]
R18  10K 0402  [RESC0402(1005)_L]
R19  10K 0402  [RESC0402(1005)_L]
R20  10K 0402  [RESC0402(1005)_L]
R21  10K 0402  [RESC0402(1005)_L]
R22  10K 0402  [RESC0402(1005)_L]
SW3  434331045822  [434331045822]
TP16  TP100_200_NS  [TP100_200_NS]  (value not drawn)  (no BOM)
TP17  TP100_200_NS  [TP100_200_NS]  (value not drawn)  (no BOM)
TP20  TP100_200_NS  [TP100_200_NS]  (value not drawn)  (no BOM)
TP21  TP100_200_NS  [TP100_200_NS]  (value not drawn)  (no BOM)

### Ports
1V8, 5V, CTL_CAM_C (harness CTL_CAM_C), CTL_CAM_D (harness CTL_CAM_D), GND, I2C0 (harness I2C0), IMU_CTRL (bidir, harness IMU_CTRL), ToF_CTRL (bidir, harness ToF_CTRL), USB (harness USB), USB_CTRL (harness USB_CTRL), VBUS

### Harnesses
USB: USB_D_P, USB_D_N, USB_TX_N, USB_TX_P, USB_RX_N, USB_RX_P
I2C0: I2C0_SDA, I2C0_SCL
ToF_CTRL: TOF_IO_1, TOF_IO_2
USB_CTRL: USB_OUT1, USB_OUT2, USB_OUT3, USB_ID
CTL_CAM_D: CAMD_PWR, CAMD_CLK
CTL_CAM_C: CAMC_PWR, CAMC_CLK
IMU_CTRL: IMU_BOOT, IMU_RST, IMU_INT, IMU_WAKE

### Nets
1V8: J3.1 R8.2 R9.2 R10.2 R11.2 R12.2 R13.2 SW3.2 SW3.4 ; port 1V8
5V: J2.5(5V) J2.6(5V) J2.7(5V) J2.8(5V) J2.9(5V) J2.10(5V) J2.11(5V) J2.12(5V) ; port 5V
GND: J2.1(GND) J2.2(GND) J2.3(GND) J2.4(GND) J2.13(GND) J2.14(GND) J2.15(GND) J2.16(GND) J2.29(GND) J2.30(GND) J2.32(GND) J2.38(GND) J2.39(RFU) J2.40(GND) J2.46(GND) J2.49(RFU) J2.55(RFU) J2.61(GND) J2.67(GND) J2.73(GND) J2.78(GND) J2.79(GND) J2.82(GND) J2.85(GND) J2.87(GND) J2.88(GND) J2.93(TRST) J2.94(GND) J2.99(TMS) J2.100(GND) J3.4 R17.1 R18.1 R19.1 R20.1 R21.1 R22.1 ; port GND
VBUS: J2.80(5V/VBUS) ; port VBUS
CAMC_CLK: J2.44(IO45/UART_TX) ; port CTL_CAM_C.CAMC_CLK
CAMC_PWR: J2.56(IO12) ; port CTL_CAM_C.CAMC_PWR
CAMD_CLK: J2.42(IO46/UART_RX) ; port CTL_CAM_D.CAMD_CLK
CAMD_PWR: J2.54(IO11) ; port CTL_CAM_D.CAMD_PWR
DBG_UART_RX: J2.57(IO27/I2C4_SDA) J3.2
DBG_UART_TX: J2.59(IO26/I2C4_SCL) J3.3
I2C0_SCL: J2.34(IO18/I2C0_SCL) ; port I2C0.I2C0_SCL
I2C0_SDA: J2.36(IO19/I2C0_SDA) ; port I2C0.I2C0_SDA
IMU_BOOTN_1V8: J2.19(IO29/I2S2_WS) TP17.1 ; port IMU_CTRL.IMU_BOOT
IMU_INT_1V8: J2.17(IO28/I2S2_SCK) TP16.1 ; port IMU_CTRL.IMU_INT
IMU_RSTn_1V8: J2.21(IO50/I2S2_IN_SD0) TP20.1 ; port IMU_CTRL.IMU_RST
IMU_WAKE_1V8: J2.23(IO30/I2S2_OUT_SD0) TP21.1 ; port IMU_CTRL.IMU_WAKE
TOF_IO_1: J2.72(IO42) ; port ToF_CTRL.TOF_IO_1
TOF_IO_2: J2.74(IO43) ; port ToF_CTRL.TOF_IO_2
USB_D_N: J2.90(USB_D_N) ; port USB.USB_D_N
USB_D_P: J2.92(USB_D_P) ; port USB.USB_D_P
USB_ID: J2.66(IO38) ; port USB_CTRL.USB_ID
USB_OUT1: J2.60(IO15) ; port USB_CTRL.USB_OUT1
USB_OUT2: J2.62(IO16) ; port USB_CTRL.USB_OUT2
USB_OUT3: J2.64(IO17) ; port USB_CTRL.USB_OUT3
USB_RX_N: J2.96(USB_RX_N) ; port USB.USB_RX_N
USB_RX_P: J2.98(USB_RX_P) ; port USB.USB_RX_P
USB_TX_N: J2.84(USB_TX_N) ; port USB.USB_TX_N
USB_TX_P: J2.86(USB_TX_P) ; port USB.USB_TX_P
NetJ2_18: J2.18(IO63BOOT4) R13.1 R14.2 R22.2
NetJ2_20: J2.20(IO62BOOT3) R12.1 R21.2
NetJ2_22: J2.22(IO61BOOT2) R11.1 R15.2 R20.2
NetJ2_24: J2.24(IO60/BOOT1) R10.1 R19.2
NetJ2_26: J2.26(IO59/BOOT0) R9.1 R18.2
NetJ2_28: J2.28(IO58/PCIe_ISO_N) R8.1 R16.2 R17.2
NetR14_1: R14.1 R15.1 R16.1 SW3.1 SW3.3

Not connected (* = marked no-connect by the designer): J2 25(IO51/I2S2_IN_SD1) 27(IO52/I2S2_IN_SD2) 31(RFU) 33(RFU) 35(RFU) 37(RFU) 41(RFU) 43(RFU) 45(RFU) 47(RFU) 48(IO6)* 50(IO9)* 51(RFU)* 52(IO10)* 53(RFU)* 58(IO14) 63(IO13/PCIe_PERST)* 65(IO55/PCIe_CLKREQ_N) 68(IO39) 69(SDS_TXD_P)* 70(IO40)* 71(SDS_TXD_N)* 75(SDS_RXD_P)* 76(RFU)* 77(SDS_RXD_N)* 81(SDS_IO_CLKI_N)* 83(SDS_IO_CLKI_P)* 89(SYS_RST)* 91(TDO)* 95(TDI)* 97(TCK)*

### Layout directives
differential pair; differential pair class 90ohm: USB_D_N, USB_D_P, USB_RX_N, USB_RX_P, USB_TX_N, USB_TX_P

### Notes on the sheet
- Title
- Size:
- Date:
- Tabloid
- Number:
- Time:
- Revision:
- Sheet
- of
- Drawn by:
- (in symbol CMP-005-000053-4) CONNECTOR B

### Library data of the parts
J2 = CMP-005-000053-4: OAK-SoM-Pro base board conn. B; Manufacturer Part Number 1: DF40HC(3.0)-100DS-0.4V(58); Manufacturer 1: Hirose; Connector Type: Receptacle; Pitch: 0.016inch; Number of Positions: 100; System: Connector; Design Item ID: DF40HC(3.0)-100DS-0.4V_SoM-PRO_B; Stock 1: 2172; Stock 2: 2078; Contact Plating: Gold; Lead Free: Lead Free; Pricing 2: 1=2.50000, 10=2.40000, 25=2.10000, 50=2.10000, 100=2.00000, 250=1.76000, 500=1.71000, 1000=1.45000, 2000=1.36000, 5000=1.31000, 10000=1.31000 (USD); ComponentLink4Description: https://datasheet.ciiva.com/18562/ed-df40-20140305-18562462.pdf?src-supplier=Digi-Key; Mount: Surface Mount; Number of Rows: 2; ComponentLink1URL: https://datasheet.ciiva.com/46636/ed-df40-20140305-46636517.pdf?src-supplier=Digi-Key; ComponentLink2URL: https://datasheet.ciiva.com/18562/ed-df40-20140305-18562189.pdf?src-supplier=Digi-Key; ComponentLink4URL: https://datasheet.ciiva.com/18562/ed-df40-20140305-18562462.pdf?src-supplier=Digi-Key; Source: LuxonisMaster.SchLib; Pricing 1: 1=2.54000, 10=2.26000, 25=2.07000, 50=2.07000, 100=1.98000, 250=1.79000, 500=1.65000, 1000=1.41000, 3000=1.32000, 6000=1.23000, 10000=1.23000 (USD); ComponentLink2Description: https://datasheet.ciiva.com/18562/ed-df40-20140305-18562189.pdf?src-supplier=Digi-Key; RoHS: Yes; ComponentLink3URL: https://datasheet.ciiva.com/13559/ed-df40-20140305-13559540.pdf?src-supplier=Mouser; Package Quantity: 1000; Packaging: Tape and Reel; ComponentLink1Description: https://datasheet.ciiva.com/46636/ed-df40-20140305-46636517.pdf?src-supplier=Digi-Key; ComponentLink3Description: https://datasheet.ciiva.com/13559/ed-df40-20140305-13559540.pdf?src-supplier=Mouser
J3 = 61300411121: CONN HEADER VERT 4POS 2.54MM  Connector Header Through Hole 4 position 0.100" (2.54mm); Manufacturer 1: Wurth Electronics; Number of Positions: 4; Gender: Male; Connector Type: Male Pin; Pitch: 0.1inch; Supplier 1: Digi-Key; Manufacturer Part Number 1: 61300411121; Stock 1: 19594; Pricing 1: 1=0.18000, 10=0.15300, 25=0.12720, 50=0.10600, 100=0.09600, 1000=0.08800 (USD); RoHS: Yes; Mount: Through Hole; Contact Plating: Gold; Contact Material: Copper; Color: Black; Number of Rows: 1; Packaging: Bulk; Termination: Solder; Number of Contacts: 4; Contact Mating Length: 0.236inch; REACH SVHC: Unknown; Lead Free: Lead Free; ComponentLink1URL: http://www.farnell.com/cad/1737268.pdf?src-supplier=Element14; ComponentLink1Description: http://www.farnell.com/cad/1737268.pdf?src-supplier=Element14; ComponentLink2URL: https://katalog.we-online.de/em/datasheet/6130xx11121.pdf?src-supplier=Digi-Key; ComponentLink2Description: https://katalog.we-online.de/em/datasheet/6130xx11121.pdf?src-supplier=Digi-Key; Supplier Part Number 1: 732-5317-ND
R8-R13 R17-R22 = RC0402FR-1310KL: RES SMD 10K OHM 1% 0402 1/16W Chip Resistor, 0402 [1005 Metric], 10 kohm, RC Series, 50 V, Thick Film, 62.5 mW; Manufacturer 1: Yageo; Resistance: 10kR; Temperature Coefficient: 100ppm/°C; Power Rating: 62.5mW; Voltage Rating: 50V; ComponentLink1URL: https://datasheet.ciiva.com/16940/pyu-rc0402-51-rohs-l-6-16940293.pdf?src-supplier=Avnet+Europe; ComponentLink1Description: https://datasheet.ciiva.com/16940/pyu-rc0402-51-rohs-l-6-16940293.pdf?src-supplier=Avnet+Europe; ComponentLink2URL: https://datasheet.ciiva.com/28386/pyu-rc0402-51-rohs-l-6-28386855.pdf?src-supplier=Avnet+Europe; ComponentLink2Description: https://datasheet.ciiva.com/28386/pyu-rc0402-51-rohs-l-6-28386855.pdf?src-supplier=Avnet+Europe; ComponentLink3URL: https://datasheet.ciiva.com/16740/pyu-rc0402-51-rohs-l-6-r-16740602.pdf?src-supplier=Future+Electronics; ComponentLink3Description: https://datasheet.ciiva.com/16740/pyu-rc0402-51-rohs-l-6-r-16740602.pdf?src-supplier=Future+Electronics; ComponentLink4URL: https://datasheet.ciiva.com/8891/pyu-rc0402-51-rohs-l-6-8891339.pdf?src-supplier=Avnet; ComponentLink4Description: https://datasheet.ciiva.com/8891/pyu-rc0402-51-rohs-l-6-8891339.pdf?src-supplier=Avnet; ComponentLink5URL: https://datasheet.ciiva.com/5557/pyu-rc0402-51-rohs-l-6-r-5557997.pdf?src-supplier=Mouser; ComponentLink5Description: https://datasheet.ciiva.com/5557/pyu-rc0402-51-rohs-l-6-r-5557997.pdf?src-supplier=Mouser; ComponentLink6URL: https://datasheet.ciiva.com/7983/1018594-7983533.pdf?src-supplier=Element14; ComponentLink6Description: https://datasheet.ciiva.com/7983/1018594-7983533.pdf?src-supplier=Element14; Supplier 1: Newark; Manufacturer Part Number 1: RC0402FR-1310KL; Stock 1: 62239; Pricing 1: 1=0.10000, 25=0.01200, 100=0.00400, 250=0.00400, 500=0.00300, 1000=0.00300 (USD); RoHS: Yes; Case/Package: 0402; Number of Pins: 2; Contact Plating: Tin,Matte,Lead; Case Code (Imperial): 0402; Case Code (Metric): 1005; Min Operating Temperature: -55°C; Max Operating Temperature: 155°C; Tolerance: 1%; Composition: Thick Film; Packaging: Tape and Reel; Termination: SMD/SMT; Military Standard: Not; Voltage Rating (DC): 50V; Working Voltage: 50V; Number of Terminations: 2; Length: 1mm; Depth: 0.5mm; Radiation Hardening: No; REACH SVHC: No SVHC; Lead Free: Lead Free; Supplier Part Number 1: 67R9960; Supplier 2: Future Electronics; Supplier 3: Mouser; Supplier 4: Element14; Supplier Part Number 2: RC0402FR-1310KL-CUTT; Supplier Part Number 3: 603-RC0402FR-1310KL; Supplier Part Number 4: 1799235
R14-R16 = CRCW04020000Z0ED: RES SMD 0 OHM JUMPER 1/16W 0402; Manufacturer 1: Vishay; Resistance: 0mR; Power Rating: 63mW; Voltage Rating: 50V; Temperature Coefficient: 100ppm/°C; Tolerance: 5%; Manufacturer Part Number 1: CRCW04020000Z0ED; Supplier 1: Digi-Key; Stock 1: 855968; Pricing 1: 1=0.10000, 10=0.03400, 25=0.02440, 50=0.01860, 100=0.01380, 250=0.01048, 500=0.00840, 1000=0.00618, 5000=0.00443 (USD); RoHS: Yes; Mount: Surface Mount; Case/Package: 0402; Weight: 2.3E-05oz; Case Code (Imperial): 0402; Case Code (Metric): 1005; Contact Plating: Tin; Min Operating Temperature: -55°C; Max Operating Temperature: 155°C; Packaging: Tape and Reel; Composition: Thick Film; Voltage Rating (DC): 50V; Package Quantity: 1; Termination: SMD/SMT; Number of Terminations: 2; Military Standard: Not; Max Power Dissipation: 63mW; Features: Automotive AEC-Q200; Length: 1mm; Height: 0.35mm; Width: 0.5mm; Depth: 0.5mm; Radiation Hardening: No; REACH SVHC: Unknown; Lead Free: Lead Free; ComponentLink1URL: https://datasheet.ciiva.com/3255/dcrcwe3-3255944.pdf?src-supplier=Avnet; ComponentLink1Description: https://datasheet.ciiva.com/3255/dcrcwe3-3255944.pdf?src-supplier=Avnet; ComponentLink2URL: https://datasheet.ciiva.com/3255/dcrcwe3-3255945.pdf?src-supplier=Avnet; ComponentLink2Description: https://datasheet.ciiva.com/3255/dcrcwe3-3255945.pdf?src-supplier=Avnet; ComponentLink3URL: https://datasheet.ciiva.com/16881/dcrcwe3-16881413.pdf?src-supplier=Avnet+Europe; ComponentLink3Description: https://datasheet.ciiva.com/16881/dcrcwe3-16881413.pdf?src-supplier=Avnet+Europe; ComponentLink4URL: https://datasheet.ciiva.com/2461/dcrcwe3-2461962.pdf?src-supplier=Digi-Key; ComponentLink4Description: https://datasheet.ciiva.com/2461/dcrcwe3-2461962.pdf?src-supplier=Digi-Key; ComponentLink5URL: https://datasheet.ciiva.com/7841/1720486-7841802.pdf?src-supplier=Element14; ComponentLink5Description: https://datasheet.ciiva.com/7841/1720486-7841802.pdf?src-supplier=Element14; ComponentLink6URL: https://datasheet.ciiva.com/2461/dcrcwe3-2461963.pdf?src-supplier=Digi-Key; ComponentLink6Description: https://datasheet.ciiva.com/2461/dcrcwe3-2461963.pdf?src-supplier=Digi-Key; ComponentLink7URL: https://datasheet.ciiva.com/2461/dcrcwe3-2461964.pdf?src-supplier=Digi-Key; ComponentLink7Description: https://datasheet.ciiva.com/2461/dcrcwe3-2461964.pdf?src-supplier=Digi-Key; ComponentLink8URL: https://datasheet.ciiva.com/7841/1697337-7841468.pdf?src-supplier=Element14; ComponentLink8Description: https://datasheet.ciiva.com/7841/1697337-7841468.pdf?src-supplier=Element14; ComponentLink9URL: https://datasheet.ciiva.com/16761/70200976-16761309.pdf?src-supplier=Allied+Electronics; ComponentLink9Description: https://datasheet.ciiva.com/16761/70200976-16761309.pdf?src-supplier=Allied+Electronics; ComponentLink10URL: https://datasheet.ciiva.com/26311/fld-crcw-e3-data-en-26311550.pdf?src-supplier=Distrelec; ComponentLink10Description: https://datasheet.ciiva.com/26311/fld-crcw-e3-data-en-26311550.pdf?src-supplier=Distrelec; Supplier Part Number 1: 541-0.0JCT-ND
SW3 = CMP-011-00016-3: as SW1 on sheet DM2080_Connector_A; Supplier Part Number 1: 732-7055-2-ND; Manufacturer part number 1: 434331045822; Pins: 4; Supplier 1: Digi-Key; Current Rating: 50mA; Mounting Technology: SMD; Case/Package: 434331045822
TP16 TP17 TP20 TP21 = TEST_POINT